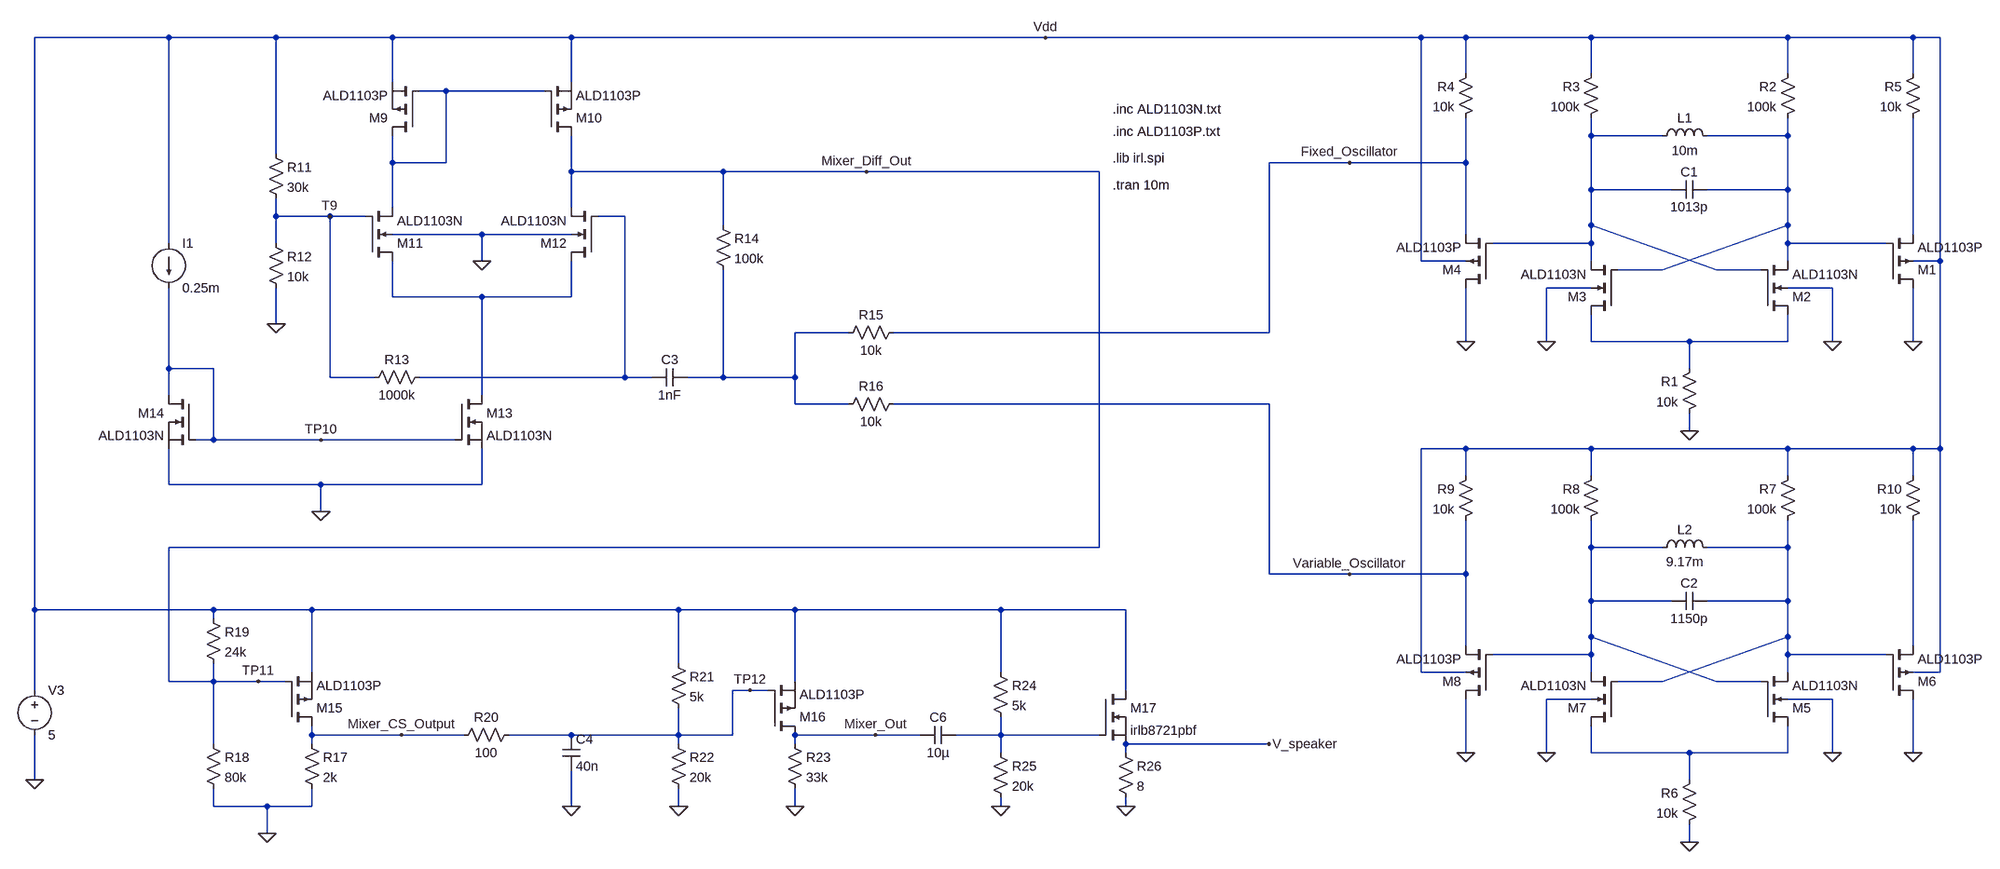
[diagram p0: schematic PreLAB 10.asc]
PreLAB 10.asc, the LTspice schematic file:
Version 4.1
SHEET 1 5732 1716
WIRE 2480 -352 2240 -352
WIRE 2672 -352 2480 -352
WIRE 2880 -352 2672 -352
WIRE 3200 -352 2880 -352
WIRE 4048 -352 3200 -352
WIRE 4720 -352 4048 -352
WIRE 4800 -352 4720 -352
WIRE 5024 -352 4800 -352
WIRE 5376 -352 5024 -352
WIRE 5600 -352 5376 -352
WIRE 5648 -352 5600 -352
WIRE 4800 -288 4800 -352
WIRE 5024 -288 5024 -352
WIRE 5376 -288 5376 -352
WIRE 5600 -288 5600 -352
WIRE 2880 -272 2880 -352
WIRE 3200 -272 3200 -352
WIRE 2976 -256 2928 -256
WIRE 3152 -256 2976 -256
WIRE 5024 -176 5024 -208
WIRE 5152 -176 5024 -176
WIRE 5376 -176 5376 -208
WIRE 5376 -176 5232 -176
WIRE 2672 -144 2672 -352
WIRE 2880 -128 2880 -176
WIRE 2976 -128 2976 -256
WIRE 2976 -128 2880 -128
WIRE 4592 -128 4448 -128
WIRE 4800 -128 4800 -208
WIRE 4800 -128 4592 -128
WIRE 3200 -112 3200 -176
WIRE 3472 -112 3200 -112
WIRE 3728 -112 3472 -112
WIRE 4144 -112 3728 -112
WIRE 5024 -80 5024 -176
WIRE 5168 -80 5024 -80
WIRE 5376 -80 5376 -176
WIRE 5376 -80 5232 -80
WIRE 2880 -48 2880 -128
WIRE 3200 -48 3200 -112
WIRE 2672 -32 2672 -64
WIRE 2768 -32 2672 -32
WIRE 2832 -32 2768 -32
WIRE 3296 -32 3248 -32
WIRE 3472 -16 3472 -112
WIRE 5024 -16 5024 -80
WIRE 5376 -16 5376 -80
WIRE 3040 0 2880 0
WIRE 3200 0 3040 0
WIRE 4800 0 4800 -128
WIRE 5600 0 5600 -208
WIRE 2480 16 2480 -352
WIRE 2672 16 2672 -32
WIRE 5024 16 5024 -16
WIRE 5024 16 4848 16
WIRE 5376 16 5376 -16
WIRE 5552 16 5376 16
WIRE 3040 48 3040 0
WIRE 4720 48 4720 -352
WIRE 4800 48 4720 48
WIRE 5024 48 5024 16
WIRE 5376 48 5376 16
WIRE 5648 48 5648 -352
WIRE 5648 48 5600 48
WIRE 5152 64 5376 -16
WIRE 5152 64 5072 64
WIRE 5248 64 5024 -16
WIRE 5328 64 5248 64
WIRE 5024 96 4944 96
WIRE 5456 96 5376 96
WIRE 2880 112 2880 48
WIRE 3040 112 2880 112
WIRE 3200 112 3200 48
WIRE 3200 112 3040 112
WIRE 2672 160 2672 96
WIRE 3696 176 3600 176
WIRE 4448 176 4448 -128
WIRE 4448 176 3776 176
WIRE 4800 192 4800 96
WIRE 4944 192 4944 96
WIRE 5024 192 5024 144
WIRE 5200 192 5024 192
WIRE 5376 192 5376 144
WIRE 5376 192 5200 192
WIRE 5456 192 5456 96
WIRE 5600 192 5600 96
WIRE 2480 240 2480 96
WIRE 2560 240 2480 240
WIRE 5200 240 5200 192
WIRE 2768 256 2768 -32
WIRE 2848 256 2768 256
WIRE 3296 256 3296 -32
WIRE 3296 256 2928 256
WIRE 3344 256 3296 256
WIRE 3472 256 3472 64
WIRE 3472 256 3408 256
WIRE 3600 256 3600 176
WIRE 3600 256 3472 256
WIRE 2480 288 2480 240
WIRE 3040 288 3040 112
WIRE 3600 304 3600 256
WIRE 3696 304 3600 304
WIRE 4448 304 3776 304
WIRE 5200 352 5200 320
WIRE 2560 368 2560 240
WIRE 2560 368 2528 368
WIRE 2752 368 2560 368
WIRE 2992 368 2752 368
WIRE 4800 384 4720 384
WIRE 5024 384 4800 384
WIRE 5376 384 5024 384
WIRE 5600 384 5376 384
WIRE 5648 384 5648 48
WIRE 5648 384 5600 384
WIRE 4800 432 4800 384
WIRE 5024 432 5024 384
WIRE 5376 432 5376 384
WIRE 5600 432 5600 384
WIRE 2480 448 2480 384
WIRE 2752 448 2480 448
WIRE 3040 448 3040 384
WIRE 3040 448 2752 448
WIRE 2752 496 2752 448
WIRE 4144 560 4144 -112
WIRE 4144 560 2480 560
WIRE 5024 560 5024 512
WIRE 5152 560 5024 560
WIRE 5376 560 5376 512
WIRE 5376 560 5232 560
WIRE 4448 608 4448 304
WIRE 4592 608 4448 608
WIRE 4800 608 4800 512
WIRE 4800 608 4592 608
WIRE 5024 656 5024 560
WIRE 5168 656 5024 656
WIRE 5376 656 5376 560
WIRE 5376 656 5232 656
WIRE 2240 672 2240 -352
WIRE 2560 672 2240 672
WIRE 2736 672 2560 672
WIRE 3392 672 2736 672
WIRE 3600 672 3392 672
WIRE 3968 672 3600 672
WIRE 4192 672 3968 672
WIRE 2560 688 2560 672
WIRE 5024 720 5024 656
WIRE 5376 720 5376 656
WIRE 4800 736 4800 608
WIRE 5600 736 5600 512
WIRE 5024 752 5024 720
WIRE 5024 752 4848 752
WIRE 5376 752 5376 720
WIRE 5552 752 5376 752
WIRE 3392 768 3392 672
WIRE 2736 784 2736 672
WIRE 3968 784 3968 672
WIRE 4720 784 4720 384
WIRE 4800 784 4720 784
WIRE 5024 784 5024 752
WIRE 5376 784 5376 752
WIRE 5648 784 5648 384
WIRE 5648 784 5600 784
WIRE 2480 800 2480 560
WIRE 2560 800 2560 768
WIRE 2560 800 2480 800
WIRE 2640 800 2560 800
WIRE 2688 800 2640 800
WIRE 3600 800 3600 672
WIRE 5152 800 5376 720
WIRE 5152 800 5072 800
WIRE 5248 800 5024 720
WIRE 5328 800 5248 800
WIRE 2240 816 2240 672
WIRE 3520 816 3488 816
WIRE 3552 816 3520 816
WIRE 4192 816 4192 672
WIRE 5024 832 4944 832
WIRE 5456 832 5376 832
WIRE 2736 896 2736 880
WIRE 2896 896 2736 896
WIRE 3008 896 2896 896
WIRE 3200 896 3088 896
WIRE 3392 896 3392 848
WIRE 3392 896 3200 896
WIRE 3488 896 3488 816
WIRE 3488 896 3392 896
WIRE 3744 896 3600 896
WIRE 3824 896 3744 896
WIRE 3968 896 3968 864
WIRE 3968 896 3888 896
WIRE 4144 896 3968 896
WIRE 2560 912 2560 800
WIRE 2736 912 2736 896
WIRE 3392 912 3392 896
WIRE 3600 912 3600 896
WIRE 4448 912 4192 912
WIRE 3968 928 3968 896
WIRE 4192 928 4192 912
WIRE 4800 928 4800 832
WIRE 4944 928 4944 832
WIRE 5024 928 5024 880
WIRE 5200 928 5024 928
WIRE 5376 928 5376 880
WIRE 5376 928 5200 928
WIRE 5456 928 5456 832
WIRE 5600 928 5600 832
WIRE 2240 976 2240 896
WIRE 5200 976 5200 928
WIRE 2560 1024 2560 992
WIRE 2656 1024 2560 1024
WIRE 2736 1024 2736 992
WIRE 2736 1024 2656 1024
WIRE 3200 1024 3200 960
WIRE 3392 1024 3392 992
WIRE 3600 1024 3600 992
WIRE 3968 1024 3968 1008
WIRE 4192 1024 4192 1008
WIRE 2656 1072 2656 1024
WIRE 5200 1088 5200 1056
FLAG 5200 352 0
FLAG 5600 192 0
FLAG 4800 192 0
FLAG 4592 -128 Fixed_Oscillator
FLAG 5456 192 0
FLAG 4944 192 0
FLAG 5200 1088 0
FLAG 5600 928 0
FLAG 4800 928 0
FLAG 4592 608 Variable_Oscillator
FLAG 5456 928 0
FLAG 4944 928 0
FLAG 2240 976 0
FLAG 3040 48 0
FLAG 2752 496 0
FLAG 2672 160 0
FLAG 3728 -112 Mixer_Diff_Out
FLAG 4048 -352 Vdd
FLAG 2656 1072 0
FLAG 2896 896 Mixer_CS_Output
FLAG 3200 1024 0
FLAG 3392 1024 0
FLAG 3600 1024 0
FLAG 3968 1024 0
FLAG 4192 1024 0
FLAG 4448 912 V_speaker
FLAG 2768 -32 T9
FLAG 2752 368 TP10
FLAG 3744 896 Mixer_Out
FLAG 2640 800 TP11
FLAG 3520 816 TP12
SYMBOL res 5216 224 M0
SYMATTR InstName R1
SYMATTR Value 10k
SYMBOL res 5392 -304 M0
SYMATTR InstName R2
SYMATTR Value 100k
SYMBOL res 5040 -304 M0
SYMATTR InstName R3
SYMATTR Value 100k
SYMBOL cap 5168 -96 M90
WINDOW 0 0 32 VBottom 2
WINDOW 3 32 32 VTop 2
SYMATTR InstName C1
SYMATTR Value 1013p
SYMBOL ind 5248 -160 M270
WINDOW 0 32 56 VTop 2
WINDOW 3 5 56 VBottom 2
SYMATTR InstName L1
SYMATTR Value 10m
SYMBOL res 4816 -304 M0
SYMATTR InstName R4
SYMATTR Value 10k
SYMBOL res 5616 -304 M0
SYMATTR InstName R5
SYMATTR Value 10k
SYMBOL nmos4 5328 144 M180
SYMATTR InstName M2
SYMATTR Value ALD1103N
SYMBOL pmos4 5552 96 M180
SYMATTR InstName M1
SYMATTR Value ALD1103P
SYMBOL nmos4 5072 144 R180
SYMATTR InstName M3
SYMATTR Value ALD1103N
SYMBOL pmos4 4848 96 R180
SYMATTR InstName M4
SYMATTR Value ALD1103P
SYMBOL res 5216 960 M0
SYMATTR InstName R6
SYMATTR Value 10k
SYMBOL res 5392 416 M0
SYMATTR InstName R7
SYMATTR Value 100k
SYMBOL res 5040 416 M0
SYMATTR InstName R8
SYMATTR Value 100k
SYMBOL cap 5168 640 M90
WINDOW 0 0 32 VBottom 2
WINDOW 3 32 32 VTop 2
SYMATTR InstName C2
SYMATTR Value 1150p
SYMBOL ind 5248 576 M270
WINDOW 0 32 56 VTop 2
WINDOW 3 5 56 VBottom 2
SYMATTR InstName L2
SYMATTR Value 9.17m
SYMBOL res 4816 416 M0
SYMATTR InstName R9
SYMATTR Value 10k
SYMBOL res 5616 416 M0
SYMATTR InstName R10
SYMATTR Value 10k
SYMBOL nmos4 5328 880 M180
SYMATTR InstName M5
SYMATTR Value ALD1103N
SYMBOL pmos4 5552 832 M180
SYMATTR InstName M6
SYMATTR Value ALD1103P
SYMBOL nmos4 5072 880 R180
SYMATTR InstName M7
SYMATTR Value ALD1103N
SYMBOL pmos4 4848 832 R180
SYMATTR InstName M8
SYMATTR Value ALD1103P
SYMBOL voltage 2240 800 R0
WINDOW 123 0 0 Left 0
WINDOW 39 0 0 Left 0
SYMATTR InstName V3
SYMATTR Value 5
SYMBOL pmos 2928 -176 R180
SYMATTR InstName M9
SYMATTR Value ALD1103P
SYMBOL pmos 3152 -176 M180
SYMATTR InstName M10
SYMATTR Value ALD1103P
SYMBOL nmos4 2832 48 M180
SYMATTR InstName M11
SYMATTR Value ALD1103N
SYMBOL nmos4 3248 48 R180
SYMATTR InstName M12
SYMATTR Value ALD1103N
SYMBOL nmos 2992 288 R0
SYMATTR InstName M13
SYMATTR Value ALD1103N
SYMBOL nmos 2528 288 M0
SYMATTR InstName M14
SYMATTR Value ALD1103N
SYMBOL current 2480 16 R0
WINDOW 123 0 0 Left 0
WINDOW 39 0 0 Left 0
SYMATTR InstName I1
SYMATTR Value 0.25m
SYMBOL res 2656 -160 R0
SYMATTR InstName R11
SYMATTR Value 30k
SYMBOL res 2656 0 R0
SYMATTR InstName R12
SYMATTR Value 10k
SYMBOL res 2944 240 R90
WINDOW 0 0 56 VBottom 2
WINDOW 3 32 56 VTop 2
SYMATTR InstName R13
SYMATTR Value 1000k
SYMBOL cap 3408 240 R90
WINDOW 0 0 32 VBottom 2
WINDOW 3 32 32 VTop 2
SYMATTR InstName C3
SYMATTR Value 1nF
SYMBOL res 3456 -32 R0
SYMATTR InstName R14
SYMATTR Value 100k
SYMBOL res 3792 160 R90
WINDOW 0 0 56 VBottom 2
WINDOW 3 32 56 VTop 2
SYMATTR InstName R15
SYMATTR Value 10k
SYMBOL res 3792 288 R90
WINDOW 0 0 56 VBottom 2
WINDOW 3 32 56 VTop 2
SYMATTR InstName R16
SYMATTR Value 10k
SYMBOL pmos 2688 880 M180
SYMATTR InstName M15
SYMATTR Value ALD1103P
SYMBOL res 2720 896 R0
SYMATTR InstName R17
SYMATTR Value 2k
SYMBOL res 2544 896 R0
SYMATTR InstName R18
SYMATTR Value 80k
SYMBOL res 2544 672 R0
SYMATTR InstName R19
SYMATTR Value 24k
SYMBOL res 3104 880 R90
WINDOW 0 0 56 VBottom 2
WINDOW 3 32 56 VTop 2
SYMATTR InstName R20
SYMATTR Value 100
SYMBOL cap 3184 896 R0
SYMATTR InstName C4
SYMATTR Value 40n
SYMBOL res 3376 752 R0
SYMATTR InstName R21
SYMATTR Value 5k
SYMBOL res 3376 896 R0
SYMATTR InstName R22
SYMATTR Value 20k
SYMBOL pmos 3552 896 M180
SYMATTR InstName M16
SYMATTR Value ALD1103P
SYMBOL res 3584 896 R0
SYMATTR InstName R23
SYMATTR Value 33k
SYMBOL cap 3888 880 R90
WINDOW 0 0 32 VBottom 2
WINDOW 3 32 32 VTop 2
SYMATTR InstName C6
SYMATTR Value 10µ
SYMBOL res 3952 768 R0
SYMATTR InstName R24
SYMATTR Value 5k
SYMBOL res 3952 912 R0
SYMATTR InstName R25
SYMATTR Value 20k
SYMBOL res 4176 912 R0
SYMATTR InstName R26
SYMATTR Value 8
SYMBOL nmos 4144 816 R0
SYMATTR InstName M17
SYMATTR Value irlb8721pbf
SYMATTR Prefix X
TEXT 4168 -224 Left 2 !.inc ALD1103N.txt
TEXT 4168 -184 Left 2 !.inc ALD1103P.txt
TEXT 4168 -136 Left 2 !.lib irl.spi
TEXT 4168 -88 Left 2 !.tran 10m

The netlist it stands for:
* PreLAB 10.asc
R1 N008 0 10k
R2 Vdd N003 100k
R3 Vdd N002 100k
C1 N002 N003 1013p
L1 N003 N002 10m
R4 Vdd Fixed_Oscillator 10k
R5 Vdd N005 10k
M2 N008 N002 N003 0 ALD1103N
M1 0 N003 N005 Vdd ALD1103P
M3 N008 N003 N002 0 ALD1103N
M4 0 N002 Fixed_Oscillator Vdd ALD1103P
R6 N013 0 10k
R7 Vdd N010 100k
R8 Vdd N009 100k
C2 N009 N010 1150p
L2 N010 N009 9.17m
R9 Vdd Variable_Oscillator 10k
R10 Vdd N011 10k
M5 N013 N009 N010 0 ALD1103N
M6 0 N010 N011 Vdd ALD1103P
M7 N013 N010 N009 0 ALD1103N
M8 0 N009 Variable_Oscillator Vdd ALD1103P
V3 Vdd 0 5
M9 N001 N001 Vdd Vdd ALD1103P
M10 TP11 N001 Vdd Vdd ALD1103P
M11 N006 T9 N001 0 ALD1103N
M12 N006 N004 TP11 0 ALD1103N
M13 N006 TP10 0 0 ALD1103N
M14 TP10 TP10 0 0 ALD1103N
I1 Vdd TP10 0.25m
R11 Vdd T9 30k
R12 T9 0 10k
R13 N004 T9 1000k
C3 N007 N004 1nF
R14 TP11 N007 100k
R15 Fixed_Oscillator N007 10k
R16 Variable_Oscillator N007 10k
M15 Mixer_CS_Output TP11 Vdd Vdd ALD1103P
R17 Mixer_CS_Output 0 2k
R18 TP11 0 80k
R19 Vdd TP11 24k
R20 TP12 Mixer_CS_Output 100
C4 TP12 0 40n
R21 Vdd TP12 5k
R22 TP12 0 20k
M16 Mixer_Out TP12 Vdd Vdd ALD1103P
R23 Mixer_Out 0 33k
C6 N012 Mixer_Out 10µ
R24 Vdd N012 5k
R25 N012 0 20k
R26 V_speaker 0 8
X§M17 Vdd N012 V_speaker irlb8721pbf  ; pins D G S
.model NMOS NMOS
.model PMOS PMOS
.lib standard.mos
.inc ALD1103N.txt
.inc ALD1103P.txt
.lib irl.spi
.tran 10m
.backanno
.end